# EAGLE schematic 02BA - Pressure (EAGLE 9.3.1)
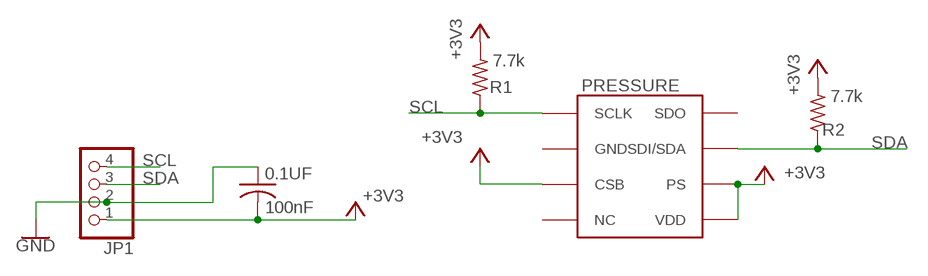
[diagram p0: schematic, sheet 1]

## Parts
0.1UF  100nF  C-USC0805  [C0805]
JP1  PINHD-1X4  [1X04]
PRESSURE  MS5803-01BA  [SMD]
R1  7.7k  R-US_R0805  [R0805]
R2  7.7k  R-US_R0805  [R0805]

## Nets
+3V3: 0.1UF.2 JP1.1 PRESSURE.CSB PRESSURE.PS PRESSURE.VDD R1.2 R2.2
GND: 0.1UF.1 JP1.2
SCL: JP1.4 PRESSURE.SCLK R1.1
SDA: JP1.3 PRESSURE.SDI/SDA R2.1
Unconnected: PRESSURE.GND PRESSURE.NC PRESSURE.SDO

## Library data of the parts
0.1UF = rcl:C-US: CAPACITOR, American symbol; SPICEPREFIX: C
JP1 = pinhead:PINHD-1X4: PIN HEADER
PRESSURE = MS5803-01BA:MS5803-01BA
R1 R2 = resistor:R-US_: RESISTOR, American symbol